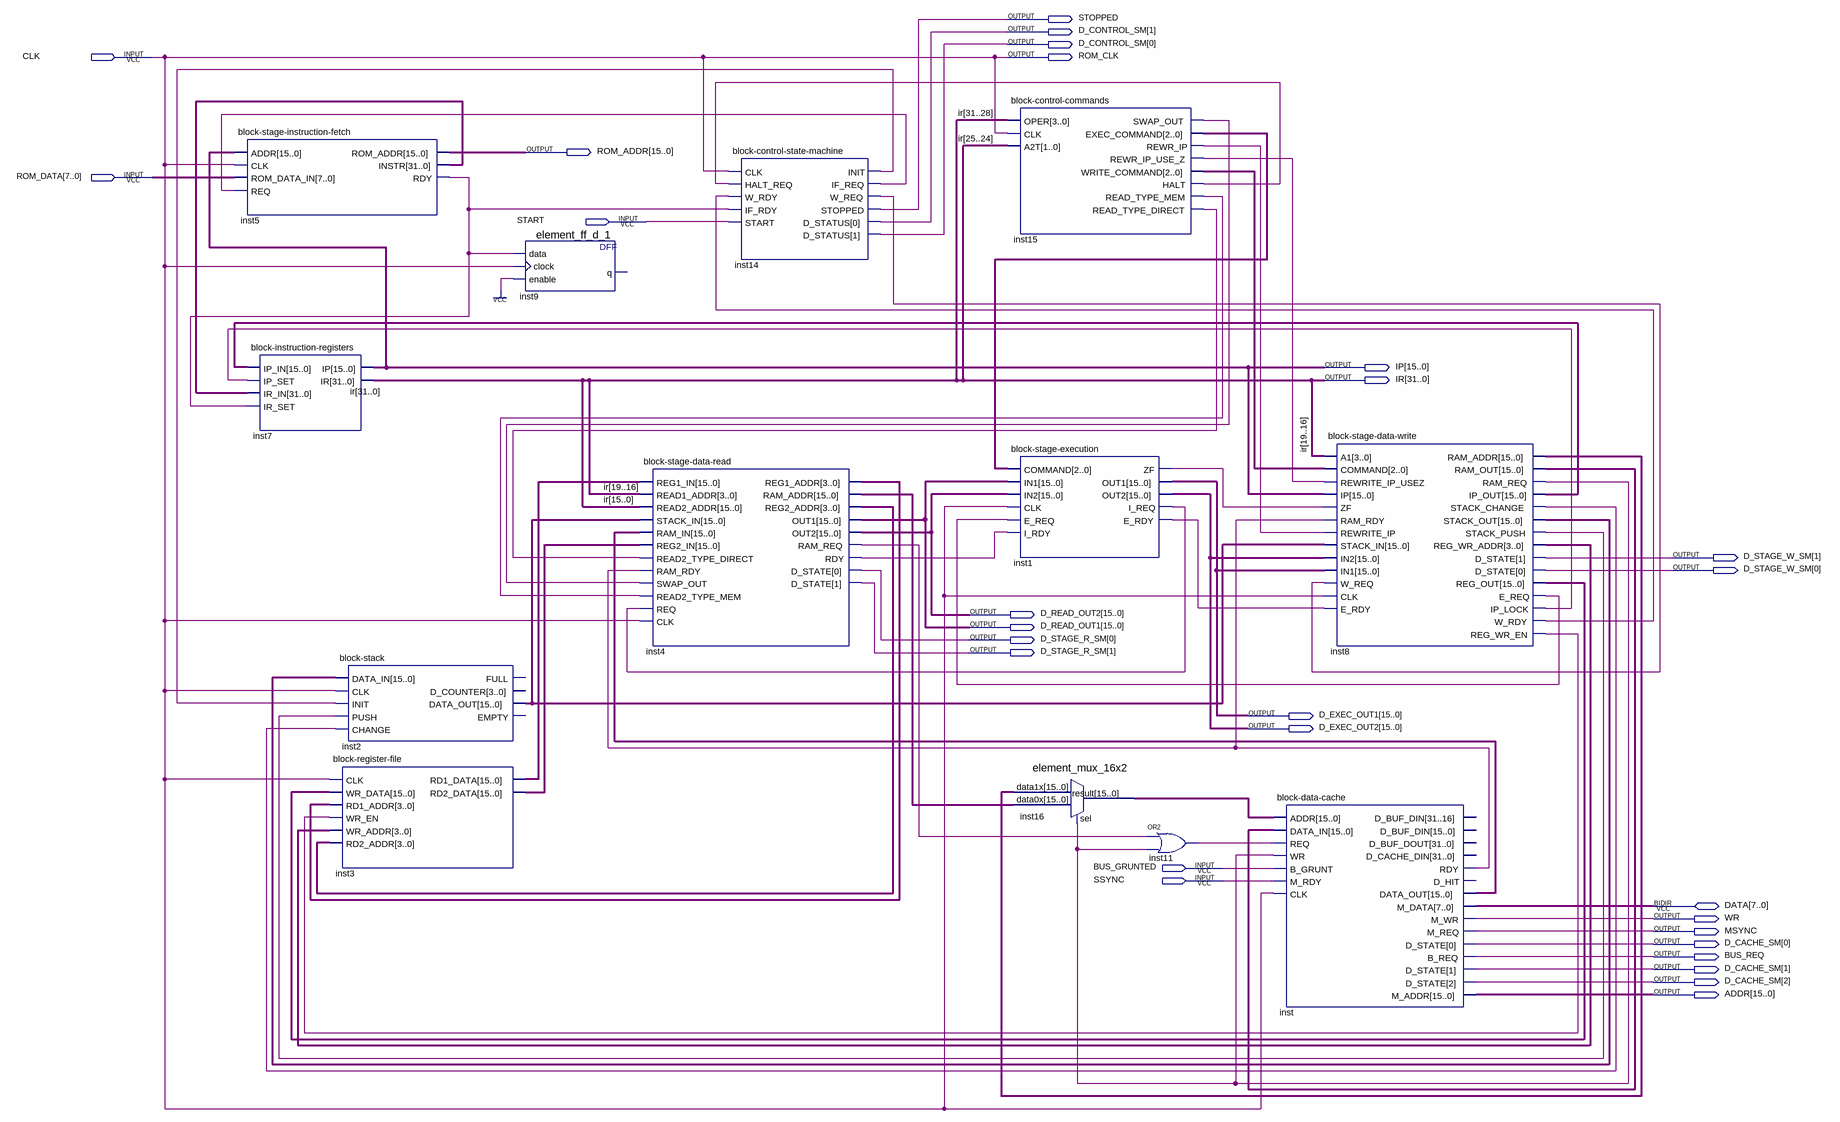
[diagram p0: schematic sheet]
// Quartus schematic block-cpu.bdf as structural Verilog: 13 symbols, 28 pins
module \block-cpu  (
  input  CLK,
  input  [7:0] ROM_DATA,
  input  START,
  input  BUS_GRUNTED,
  input  SSYNC,
  inout  [7:0] DATA,
  output STOPPED,
  output [1:0] D_CONTROL_SM,
  output ROM_CLK,
  output [15:0] ROM_ADDR,
  output [15:0] IP,
  output [31:0] IR,
  output [1:0] D_STAGE_W_SM,
  output [15:0] D_READ_OUT2,
  output [15:0] D_READ_OUT1,
  output [1:0] D_STAGE_R_SM,
  output [15:0] D_EXEC_OUT1,
  output [15:0] D_EXEC_OUT2,
  output WR,
  output MSYNC,
  output [2:0] D_CACHE_SM,
  output BUS_REQ,
  output [15:0] ADDR
);

  wire inst1_e_rdy, inst1_i_req, inst1_zf, inst4_ram_req, inst4_rdy, inst5_rdy, inst8_e_req, inst8_ip_lock,
       inst8_ram_req, inst8_reg_wr_en, inst8_stack_change, inst8_stack_push, inst8_w_rdy, inst11_out,
       inst14_if_req, inst14_init, inst14_w_req, inst15_halt, inst15_read_type_direct, inst15_read_type_mem,
       inst15_rewr_ip, inst15_rewr_ip_use_z, inst15_swap_out, inst_rdy;
  wire [2:0] inst15_exec_command, inst15_write_command;
  wire [3:0] inst4_reg1_addr, inst4_reg2_addr, inst8_reg_wr_addr;
  wire [15:0] inst2_data_out, inst3_rd1_data, inst3_rd2_data, inst4_ram_addr, inst8_ip_out, inst8_ram_addr,
       inst8_ram_out, inst8_reg_out, inst8_stack_out, inst16_result, inst_data_out;
  wire [31:0] inst5_instr;

  \block-stage-instruction-fetch  inst5 (
    .ADDR(IP), .CLK(CLK), .ROM_DATA_IN(ROM_DATA), .REQ(inst14_if_req), .ROM_ADDR(ROM_ADDR),
    .INSTR(inst5_instr), .RDY(inst5_rdy));
  \block-instruction-registers  inst7 (
    .IP_IN(inst8_ip_out), .IP_SET(inst8_ip_lock), .IR_IN(inst5_instr), .IR_SET(inst5_rdy), .IP(IP), .IR(IR));
  \block-stack  inst2 (
    .DATA_IN(inst8_stack_out), .CLK(CLK), .INIT(inst14_init), .PUSH(inst8_stack_push),
    .CHANGE(inst8_stack_change), .DATA_OUT(inst2_data_out));  // open: FULL, D_COUNTER, EMPTY
  \block-register-file  inst3 (
    .CLK(CLK), .WR_DATA(inst8_reg_out), .RD1_ADDR(inst4_reg1_addr), .WR_EN(inst8_reg_wr_en),
    .WR_ADDR(inst8_reg_wr_addr), .RD2_ADDR(inst4_reg2_addr), .RD1_DATA(inst3_rd1_data),
    .RD2_DATA(inst3_rd2_data));
  element_ff_d_1 inst9 (.data(inst5_rdy), .clock(CLK), .enable(1'b1));  // open: q
  \block-stage-data-read  inst4 (
    .REG1_IN(inst3_rd1_data), .READ1_ADDR(IR[19:16]), .READ2_ADDR(IR[15:0]), .STACK_IN(inst2_data_out),
    .RAM_IN(inst_data_out), .REG2_IN(inst3_rd2_data), .READ2_TYPE_DIRECT(inst15_read_type_direct),
    .RAM_RDY(inst_rdy), .SWAP_OUT(inst15_swap_out), .READ2_TYPE_MEM(inst15_read_type_mem), .REQ(inst1_i_req),
    .CLK(CLK), .REG1_ADDR(inst4_reg1_addr), .RAM_ADDR(inst4_ram_addr), .REG2_ADDR(inst4_reg2_addr),
    .OUT1(D_READ_OUT1), .OUT2(D_READ_OUT2), .RAM_REQ(inst4_ram_req), .RDY(inst4_rdy), .D_STATE(D_STAGE_R_SM));
  \block-control-state-machine  inst14 (
    .CLK(CLK), .HALT_REQ(inst15_halt), .W_RDY(inst8_w_rdy), .IF_RDY(inst5_rdy), .START(START),
    .INIT(inst14_init), .IF_REQ(inst14_if_req), .W_REQ(inst14_w_req), .STOPPED(STOPPED),
    .D_STATUS({D_CONTROL_SM[0], D_CONTROL_SM[1]}));
  \block-control-commands  inst15 (
    .OPER(IR[31:28]), .CLK(CLK), .A2T(IR[25:24]), .SWAP_OUT(inst15_swap_out),
    .EXEC_COMMAND(inst15_exec_command), .REWR_IP(inst15_rewr_ip), .REWR_IP_USE_Z(inst15_rewr_ip_use_z),
    .WRITE_COMMAND(inst15_write_command), .HALT(inst15_halt), .READ_TYPE_MEM(inst15_read_type_mem),
    .READ_TYPE_DIRECT(inst15_read_type_direct));
  \block-stage-execution  inst1 (
    .COMMAND(inst15_exec_command), .IN1(D_READ_OUT1), .IN2(D_READ_OUT2), .CLK(CLK), .E_REQ(inst8_e_req),
    .I_RDY(inst4_rdy), .ZF(inst1_zf), .OUT1(D_EXEC_OUT1), .OUT2(D_EXEC_OUT2), .I_REQ(inst1_i_req),
    .E_RDY(inst1_e_rdy));
  element_mux_16x2 inst16 (
    .data1x(inst8_ram_addr), .data0x(inst4_ram_addr), .sel(inst8_ram_req), .result(inst16_result));
  or inst11 (inst11_out, inst4_ram_req, inst8_ram_req);
  \block-data-cache  inst (
    .ADDR(inst16_result), .DATA_IN(inst8_ram_out), .REQ(inst11_out), .WR(inst8_ram_req),
    .B_GRUNT(BUS_GRUNTED), .M_RDY(SSYNC), .CLK(CLK), .RDY(inst_rdy), .DATA_OUT(inst_data_out), .M_WR(WR),
    .M_REQ(MSYNC), .D_STATE(D_CACHE_SM), .B_REQ(BUS_REQ), .M_ADDR(ADDR), .M_DATA(DATA));  // open: D_BUF_DIN, D_BUF_DOUT, D_CACHE_DIN, D_HIT
  \block-stage-data-write  inst8 (
    .A1(IR[19:16]), .COMMAND(inst15_write_command), .REWRITE_IP_USEZ(inst15_rewr_ip_use_z), .IP(IP),
    .ZF(inst1_zf), .RAM_RDY(inst_rdy), .REWRITE_IP(inst15_rewr_ip), .STACK_IN(inst2_data_out),
    .IN2(D_EXEC_OUT2), .IN1(D_EXEC_OUT1), .W_REQ(inst14_w_req), .CLK(CLK), .E_RDY(inst1_e_rdy),
    .RAM_ADDR(inst8_ram_addr), .RAM_OUT(inst8_ram_out), .RAM_REQ(inst8_ram_req), .IP_OUT(inst8_ip_out),
    .STACK_CHANGE(inst8_stack_change), .STACK_OUT(inst8_stack_out), .STACK_PUSH(inst8_stack_push),
    .REG_WR_ADDR(inst8_reg_wr_addr), .D_STATE(D_STAGE_W_SM), .REG_OUT(inst8_reg_out), .E_REQ(inst8_e_req),
    .IP_LOCK(inst8_ip_lock), .W_RDY(inst8_w_rdy), .REG_WR_EN(inst8_reg_wr_en));

  assign ROM_CLK = CLK;
endmodule
